# Altium schematic sheet MCU_ESP32S3FH4R2.SchDoc
size A4; SheetNumber: 6; SheetTotal: 7
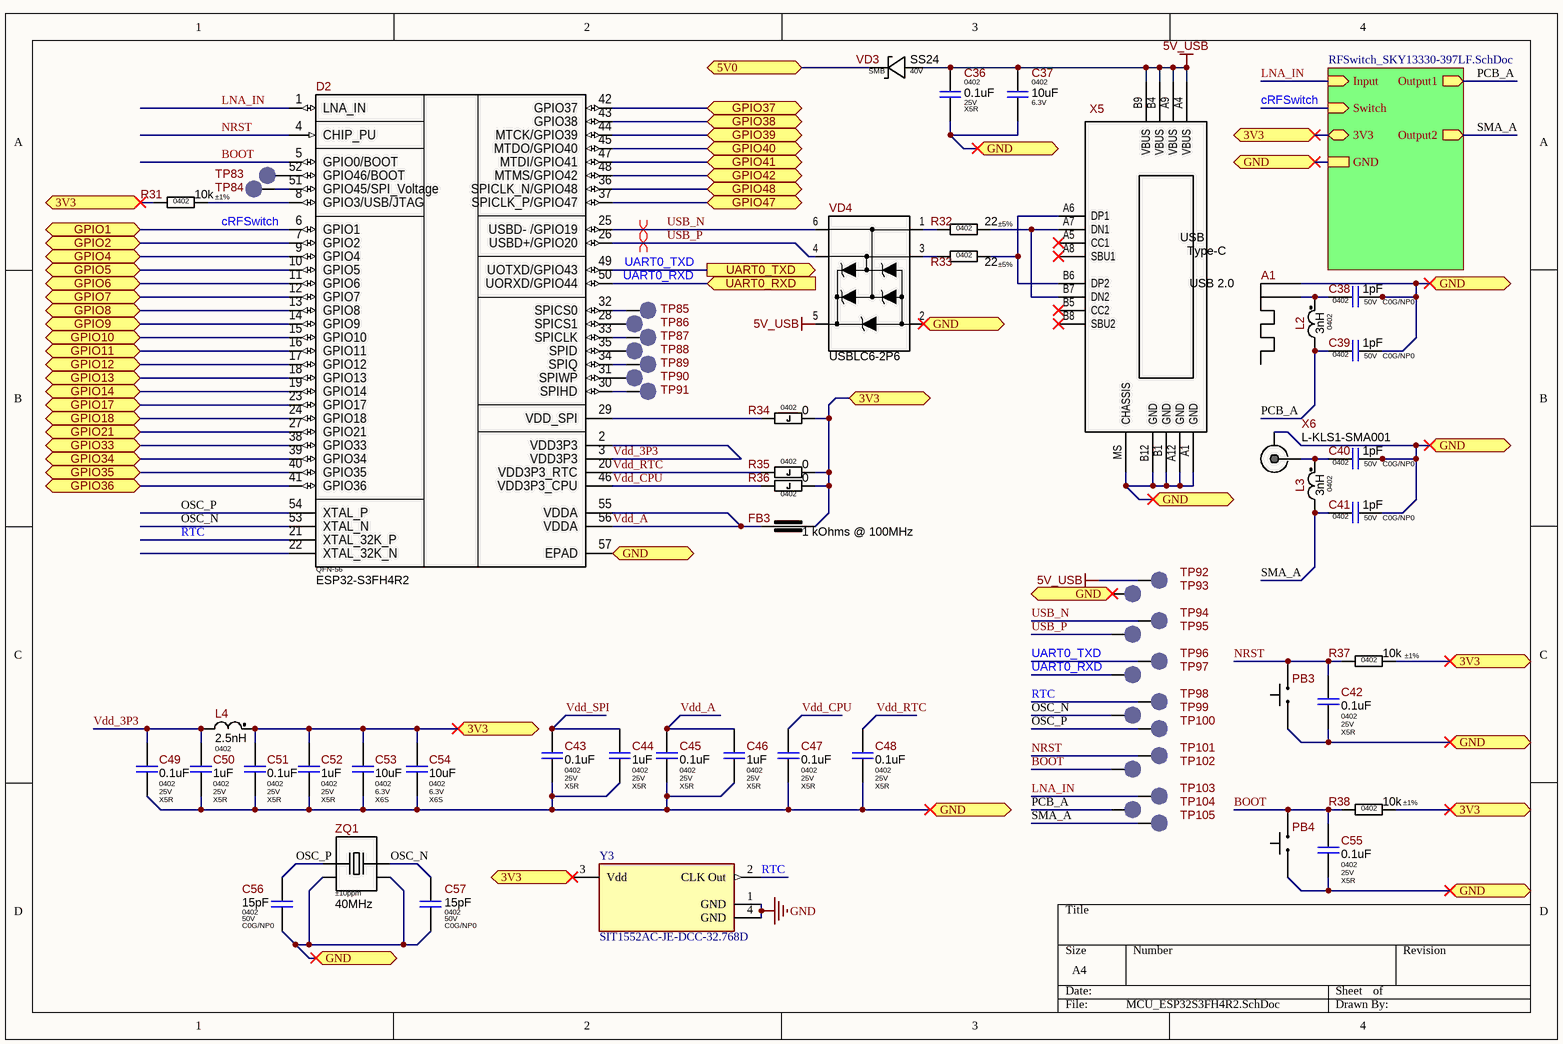
[diagram p0: MCU_ESP32S3FH4R2.SchDoc]

## Parts
A1  PCB Antenna 2.4GHz  [PCB ANTENNA 2.4GHZ]  (value not drawn)  (net tie, no BOM)
C36  Package: 0402  Voltage: 25V  Dielectric Type: X5R  [C_CERAMIC_0402_MED]  (hidden comment: 0.1uF)
C37  Package: 0402  Voltage: 6.3V  [C_CERAMIC_0402_MED]  (hidden comment: 10uF)
C38  value 1pF  Package: 0402  Voltage: 50V  Dielectric Type: C0G/NP0  [C_CERAMIC_0402_MED]  (hidden comment: 1.0pF)
C39  value 1pF  Package: 0402  Voltage: 50V  Dielectric Type: C0G/NP0  [C_CERAMIC_0402_MED]  (hidden comment: 1.0pF)
C40  value 1pF  Package: 0402  Voltage: 50V  Dielectric Type: C0G/NP0  [C_CERAMIC_0402_MED]  (hidden comment: 1.0pF)
C41  value 1pF  Package: 0402  Voltage: 50V  Dielectric Type: C0G/NP0  [C_CERAMIC_0402_MED]  (hidden comment: 1.0pF)
C42  Package: 0402  Voltage: 25V  Dielectric Type: X5R  [C_CERAMIC_0402_HI]  (hidden comment: 0.1uF)
C43  Package: 0402  Voltage: 25V  Dielectric Type: X5R  [C_CERAMIC_0402_MED]  (hidden comment: 0.1uF)
C44  Package: 0402  Voltage: 25V  Dielectric Type: X5R  [C_CERAMIC_0402_MED]  (hidden comment: 1uF)
C45  Package: 0402  Voltage: 25V  Dielectric Type: X5R  [C_CERAMIC_0402_MED]  (hidden comment: 0.1uF)
C46  Package: 0402  Voltage: 25V  Dielectric Type: X5R  [C_CERAMIC_0402_MED]  (hidden comment: 1uF)
C47  Package: 0402  Voltage: 25V  Dielectric Type: X5R  [C_CERAMIC_0402_MED]  (hidden comment: 0.1uF)
C48  Package: 0402  Voltage: 25V  Dielectric Type: X5R  [C_CERAMIC_0402_MED]  (hidden comment: 0.1uF)
C49  Package: 0402  Voltage: 25V  Dielectric Type: X5R  [C_CERAMIC_0402_MED]  (hidden comment: 0.1uF)
C50  Package: 0402  Voltage: 25V  Dielectric Type: X5R  [C_CERAMIC_0402_MED]  (hidden comment: 1uF)
C51  Package: 0402  Voltage: 25V  Dielectric Type: X5R  [C_CERAMIC_0402_MED]  (hidden comment: 0.1uF)
C52  Package: 0402  Voltage: 25V  Dielectric Type: X5R  [C_CERAMIC_0402_MED]  (hidden comment: 1uF)
C53  Package: 0402  Voltage: 6.3V  Dielectric Type: X6S  [C_CERAMIC_0402_MED]  (hidden comment: 10uF)
C54  Package: 0402  Voltage: 6.3V  Dielectric Type: X6S  [C_CERAMIC_0402_MED]  (hidden comment: 10uF)
C55  Package: 0402  Voltage: 25V  Dielectric Type: X5R  [C_CERAMIC_0402_HI]  (hidden comment: 0.1uF)
C56  Package: 0402  Voltage: 50V  Dielectric Type: C0G/NP0  [C_CERAMIC_0402_MED]  (hidden comment: 15pF)
C57  Package: 0402  Voltage: 50V  Dielectric Type: C0G/NP0  [C_CERAMIC_0402_MED]  (hidden comment: 15pF)
D2  Package: QFN-56  [QFN-56_ESP32_7X7_EXP]  (hidden comment: ESP32-S3FH4R2)
FB3  value 1 kOhms @ 100MHz  [BLM15xxxxxSN1x_MED]  (hidden comment: BLM15AX102SN1D)
L2  Package: 0402  [MLG1005S_MED]  (hidden comment: 3nH)
L3  Package: 0402  [MLG1005S_MED]  (hidden comment: 3nH)
L4  Package: 0402  [LQW15ANxxxx00x_REC]  (hidden comment: 2.5nH)
PB3  DS1042-24-2017VBR16005  [DS1042-24-2017VB]  (value not drawn)
PB4  DS1042-24-2017VBR16005  [DS1042-24-2017VB]  (value not drawn)
R31  Tolerance: ±1%  Package: 0402  [R_ANY_CHIP_0402_MED]  (hidden comment: 10k)
R32  Tolerance: ±5%  Package: 0402  [R_ANY_CHIP_0402_MED]  (hidden comment: 22)
R33  Tolerance: ±5%  Package: 0402  [R_ANY_CHIP_0402_MED]  (hidden comment: 22)
R34  Package: 0402  [R_ANY_CHIP_0402_MED]  (hidden comment: 0)
R35  Package: 0402  [R_ANY_CHIP_0402_MED]  (hidden comment: 0)
R36  Package: 0402  [R_ANY_CHIP_0402_MED]  (hidden comment: 0)
R37  Tolerance: ±1%  Package: 0402  [R_ANY_CHIP_0402_MED]  (hidden comment: 10k)
R38  Tolerance: ±1%  Package: 0402  [R_ANY_CHIP_0402_MED]  (hidden comment: 10k)
TP83  LED_LINK  [TP_SMD_2mm]  (value not drawn)  (no BOM)
TP84  LED_LINK  [TP_SMD_2mm]  (value not drawn)  (no BOM)
TP85  LED_LINK  [TP_SMD_2mm]  (value not drawn)  (no BOM)
TP86  LED_LINK  [TP_SMD_2mm]  (value not drawn)  (no BOM)
TP87  LED_LINK  [TP_SMD_2mm]  (value not drawn)  (no BOM)
TP88  LED_LINK  [TP_SMD_2mm]  (value not drawn)  (no BOM)
TP89  LED_LINK  [TP_SMD_2mm]  (value not drawn)  (no BOM)
TP90  LED_LINK  [TP_SMD_2mm]  (value not drawn)  (no BOM)
TP91  LED_LINK  [TP_SMD_2mm]  (value not drawn)  (no BOM)
TP92  LED_LINK  [TP_SMD_2mm]  (value not drawn)  (no BOM)
TP93  LED_LINK  [TP_SMD_2mm]  (value not drawn)  (no BOM)
TP94  LED_LINK  [TP_SMD_2mm]  (value not drawn)  (no BOM)
TP95  LED_LINK  [TP_SMD_2mm]  (value not drawn)  (no BOM)
TP96  LED_LINK  [TP_SMD_2mm]  (value not drawn)  (no BOM)
TP97  LED_LINK  [TP_SMD_2mm]  (value not drawn)  (no BOM)
TP98  LED_LINK  [TP_SMD_2mm]  (value not drawn)  (no BOM)
TP99  LED_LINK  [TP_SMD_2mm]  (value not drawn)  (no BOM)
TP100  LED_LINK  [TP_SMD_2mm]  (value not drawn)  (no BOM)
TP101  LED_LINK  [TP_SMD_2mm]  (value not drawn)  (no BOM)
TP102  LED_LINK  [TP_SMD_2mm]  (value not drawn)  (no BOM)
TP103  LED_LINK  [TP_SMD_2mm]  (value not drawn)  (no BOM)
TP104  LED_LINK  [TP_SMD_2mm]  (value not drawn)  (no BOM)
TP105  LED_LINK  [TP_SMD_2mm]  (value not drawn)  (no BOM)
VD3  Package: SMB  Voltage: 40V  [SMB_MED]  (hidden comment: SS24)
VD4  USBLC6-2P6  [SOT-666]
X5  USB4105-GF-A  [USB4105-GF-A]  (value not drawn)
X6  KLS1-SMA001  [L-KLS1-SMA001]  (value not drawn)
Y3  SIT1552AC-JE-DCC-32.768D  [FP-SiT1552-J-MFG]
ZQ1  Frequency Tolerance: ±10ppm  Frequency: 40MHz  [CXA-221_REC]  (hidden comment: CXA-040000-2F8F31)

## Sub-sheets
LDO_3V3 = RFSwitch_SKY13330-397LF.SchDoc: Input (in), GND, Switch (in), Output1 (out), Output2 (out), 3V3 (bidir)

## Ports
3V3 (bidir, see EL.MBRD.T01[4C], DC-DC_5V0_To_3V3[3B], MCU_STM32L010K4T6[1A], MCU_STM32L010K4T6[1C], MCU_STM32L010K4T6[2C], MCU_STM32L010K4T6[4A], MCU_STM32L010K4T6[4B], RFSwitch_SKY13330-397LF[1B], RS-485_SN65HVD72DRBR[1B]), 5V0 (bidir, see EL.MBRD.T01[5C]), GND (bidir, see EL.MBRD.T01[4C], RFSwitch_SKY13330-397LF[1B], RFSwitch_SKY13330-397LF[1C], RFSwitch_SKY13330-397LF[3C], RFSwitch_SKY13330-397LF[4B], RFSwitch_SKY13330-397LF[4C]), GPIO1 (bidir, see EL.MBRD.T01[4D]), GPIO2 (bidir, see EL.MBRD.T01[4D]), GPIO4 (bidir, see EL.MBRD.T01[4D]), GPIO5 (bidir, see EL.MBRD.T01[4D]), GPIO6 (bidir, see EL.MBRD.T01[4D]), GPIO7 (bidir, see EL.MBRD.T01[4D]), GPIO8 (bidir, see EL.MBRD.T01[4D]), GPIO9 (bidir, see EL.MBRD.T01[4D]), GPIO10 (bidir, see EL.MBRD.T01[4D]), GPIO11 (bidir, see EL.MBRD.T01[4D]), GPIO12 (bidir, see EL.MBRD.T01[4D]), GPIO13 (bidir, see EL.MBRD.T01[4D]), GPIO14 (bidir, see EL.MBRD.T01[4D]), GPIO17 (bidir, see EL.MBRD.T01[4D]), GPIO18 (bidir, see EL.MBRD.T01[5D]), GPIO21 (bidir, see EL.MBRD.T01[5D]), GPIO33 (bidir, see EL.MBRD.T01[5D]), GPIO34 (bidir, see EL.MBRD.T01[5D]), GPIO35 (bidir, see EL.MBRD.T01[5D]), GPIO36 (bidir, see EL.MBRD.T01[5D]), GPIO37 (bidir, see EL.MBRD.T01[5D]), GPIO38 (bidir, see EL.MBRD.T01[5D]), GPIO39 (bidir, see EL.MBRD.T01[5D]), GPIO40 (bidir, see EL.MBRD.T01[5D]), GPIO41 (bidir, see EL.MBRD.T01[5D]), GPIO42 (bidir), GPIO47 (bidir, see EL.MBRD.T01[5D]), GPIO48 (bidir, see EL.MBRD.T01[5D]), UART0_RXD (in), UART0_TXD (out)

## Nets
5V_USB: C36.1 C37.1 TP92.1 VD3.AN VD4.5(VBUS) X5.A4(VBUS) X5.A9(VBUS) X5.B4(VBUS) X5.B9(VBUS)
GND: Y3.1(GND) Y3.4(GND)
3V3: C51.1 C52.1 C53.1 C54.1 FB3.1 L4.1 R31.2 R34.1 R35.1 R36.1 R37.1 R38.1 Y3.3(Vdd) ; port 3V3, sheet LDO_3V3/3V3
5V0: VD3.CA ; port 5V0
BOOT: C55.1 D2.5(GPIO0/BOOT) PB4.2 R38.2 TP102.1
cRFSwitch: D2.6(GPIO1) ; port GPIO1, sheet LDO_3V3/Switch
GND: A1.1(FEED) C36.2 C37.2 C38.2 C39.2 C40.2 C41.2 C42.2 C43.2 C44.1 C45.2 C46.2 C47.2 C48.2 C49.2 C50.2 C51.2 C52.2 C53.2 C54.2 C55.2 C56.2 C57.2 D2.57(EPAD) PB3.1 PB4.1 TP93.1 VD4.2(GND) X5.A1(GND) X5.A12(GND) X5.B1(GND) X5.B12(GND) X5.MS(CHASSIS) X6.2 ZQ1.2(NC1) ZQ1.4(NC2) ; port GND, sheet LDO_3V3/GND  [a separate net that carries the same name]
GPIO2: D2.7(GPIO2) ; port GPIO2
GPIO4: D2.9(GPIO4) ; port GPIO4
GPIO5: D2.10(GPIO5) ; port GPIO5
GPIO6: D2.11(GPIO6) ; port GPIO6
GPIO7: D2.12(GPIO7) ; port GPIO7
GPIO8: D2.13(GPIO8) ; port GPIO8
GPIO9: D2.14(GPIO9) ; port GPIO9
GPIO10: D2.15(GPIO10) ; port GPIO10
GPIO11: D2.16(GPIO11) ; port GPIO11
GPIO12: D2.17(GPIO12) ; port GPIO12
GPIO13: D2.18(GPIO13) ; port GPIO13
GPIO14: D2.19(GPIO14) ; port GPIO14
GPIO17: D2.23(GPIO17) ; port GPIO17
GPIO18: D2.24(GPIO18) ; port GPIO18
GPIO21: D2.27(GPIO21) ; port GPIO21
GPIO33: D2.38(GPIO33) ; port GPIO33
GPIO34: D2.39(GPIO34) ; port GPIO34
GPIO35: D2.40(GPIO35) ; port GPIO35
GPIO36: D2.41(GPIO36) ; port GPIO36
GPIO37: D2.42(GPIO37) ; port GPIO37
GPIO38: D2.43(GPIO38) ; port GPIO38
GPIO39: D2.44(MTCK/GPIO39) ; port GPIO39
GPIO40: D2.45(MTDO/GPIO40) ; port GPIO40
GPIO41: D2.47(MTDI/GPIO41) ; port GPIO41
GPIO42: D2.48(MTMS/GPIO42) ; port GPIO42
GPIO47: D2.37(SPICLK_P/GPIO47) ; port GPIO47
GPIO48: D2.36(SPICLK_N/GPIO48) ; port GPIO48
LNA_IN: D2.1(LNA_IN) TP103.1 ; sheet LDO_3V3/Input
NRST: C42.1 D2.4(CHIP_PU) PB3.2 R37.2 TP101.1
OSC_N: C57.1 D2.53(XTAL_N) TP99.1 ZQ1.1(XTAL1)
OSC_P: C56.1 D2.54(XTAL_P) TP100.1 ZQ1.3(XTAL2)
PCB_A: C39.1 L2.2 TP104.1 ; sheet LDO_3V3/Output1
RTC: D2.21(XTAL_32K_P) TP98.1 Y3.2(CLK_Out)
SMA_A: C41.1 L3.2 TP105.1 ; sheet LDO_3V3/Output2
UART0_RXD: D2.50(UORXD/GPIO44) TP97.1 ; port UART0_RXD
UART0_TXD: D2.49(UOTXD/GPIO43) TP96.1 ; port UART0_TXD
USB_N: D2.25(USBD-_/GPIO19) TP94.1 VD4.6(D+OUT)
USB_P: D2.26(USBD+/GPIO20) TP95.1 VD4.4(D-OUT)
Vdd_3P3: C49.1 C50.1 D2.2(VDD3P3) D2.3(VDD3P3) L4.2
Vdd_A: C45.1 C46.1 D2.55(VDDA) D2.56(VDDA) FB3.2
Vdd_CPU: C47.1 D2.46(VDD3P3_CPU) R36.2
Vdd_RTC: C48.1 D2.20(VDD3P3_RTC) R35.2
Vdd_SPI: C43.1 C44.2
NetA1_2: A1.2(GND) C38.1 L2.1
NetC40_1: C40.1 L3.1 X6.1
NetD2_8: D2.8(GPIO3/USB/JTAG) R31.1
NetD2_28: D2.28(SPICS1) TP86.1
NetD2_29: D2.29(VDD_SPI) R34.2
NetD2_30: D2.30(SPIHD) TP91.1
NetD2_31: D2.31(SPIWP) TP90.1
NetD2_32: D2.32(SPICS0) TP85.1
NetD2_33: D2.33(SPICLK) TP87.1
NetD2_34: D2.34(SPIQ) TP89.1
NetD2_35: D2.35(SPID) TP88.1
NetD2_51: D2.51(GPIO45/SPI_Voltage) TP84.1
NetD2_52: D2.52(GPIO46/BOOT) TP83.1
NetR32_1: R32.1 VD4.1(D+IN)
NetR32_2: R32.2 X5.A7(DN1) X5.B7(DN2)
NetR33_1: R33.1 VD4.3(D-IN)
NetR33_2: R33.2 X5.A6(DP1) X5.B6(DP2)

Not connected (* = marked no-connect by the designer): D2 22(XTAL_32K_N); X5 A5(CC1)* A8(SBU1)* B5(CC2)* B8(SBU2)*

## Layout directives
differential pair: USB_N, USB_P

## Notes on the sheet
- (in symbol USB4105-GF-A) Type-C; USB 2.0

## Library data of the parts
A1 = 2.4GHZ-PCB-ANT: Replacement: NONE; Part Number: 2.4GHZ-PCB-ANT; Component Type: SMD; Temperature Range: NONE; ComponentLink1URL: NONE; Price: NONE; ComponentLink1Description: Datasheet
C36 C43 C45 C47-C49 C51 = Capacitor-NonPolar: 100nF 25V X5R ±10% 0402 Ceramic Capacitor RoHS; Part Number: CL05A104KA5NNNC; Manufacturer: Samsung Electro-Mechanics; Standard Lead Time: 38 Weeks; Replacement: NONE; Component Status: Released; Value: 0.1uF; Part Type: Ceramic / X5R / 0402; Component Type: SMD; Temperature Range: -55°C ~ 85°C; Tolerance: ±10%; ComponentLink1URL: https://eu.mouser.com/datasheet/2/585/MLCC-1837944.pdf; Supplier 1: Mouser; Supplier Part Number 1: 187-CL05A104KA5NNNC; ComponentLink1Description: Datasheet; Price: 0.0013
C37 = Capacitor-NonPolar: 10uF 6.3V X6S ±20% 0402 Ceramic Capacitor RoHS; Part Number: GRM155C80J106ME11D; Manufacturer: Murata Electronics; Standard Lead Time: 15 Weeks; Component Status: Released; Replacement: NONE; Value: 10uF; Part Type: Ceramic / X6S / 0402; Component Type: SMD; Temperature Range: -55°C ~ 105°C; Tolerance: ±20%; Dielectric Type: X6S; ComponentLink1URL: https://search.murata.co.jp/Ceramy/image/img/A01X/G101/ENG/GRM155C80J106ME11-01.pdf; Price: 0,01104; ComponentLink1Description: Datasheet; Supplier 1: Digi-Key; Supplier Part Number 1: 490-13233-1-ND
C38-C41 = Capacitor-NonPolar: 1.0pF 50V NP0 ±0.1pF 0402 Ceramic Capacitor RoHS; Part Number: CL05C010BB5NNNC; Manufacturer: Samsung Electro-Mechanics; Standard Lead Time: 22 Weeks; Replacement: NONE; Component Status: Released; Part Type: Ceramic / C0G(NP0) / 0402; Component Type: SMD; Temperature Range: -55°C ~ 125°C; Tolerance: ±0.1pF; ComponentLink1URL: https://media.digikey.com/pdf/Data%20Sheets/Samsung%20PDFs/CL_Series_MLCC_ds.pdf; Supplier 1: Digi-Key; Supplier Part Number 1: 1276-1237-2-ND; Price: 0,00237556; ComponentLink1Description: Datasheet
C42 C55 = CL05A104KA5NNNC: 100nF 25V X5R ±10% 0402 Ceramic Capacitor RoHS; Manufacturer: Samsung Electro-Mechanics; Standard Lead Time: 38 Weeks; Replacement: NONE; Component Status: Released; Value: 0.1uF; Part Number: CL05A104KA5NNNC; Part Type: Ceramic / X5R / 0402; Component Type: SMD; Temperature Range: -55°C ~ 85°C; Tolerance: ±10%; ComponentLink1URL: https://eu.mouser.com/datasheet/2/585/MLCC-1837944.pdf; Supplier 1: Mouser; Supplier Part Number 1: 187-CL05A104KA5NNNC; ComponentLink1Description: Datasheet; Price: 0.0013
C44 C46 C50 C52 = Capacitor-NonPolar: 1uF 25V Х5R ±10% 0402 Ceramic Capacitor RoHS; Part Number: GRM155R61E105KA12D; Manufacturer: Murata Electronics; Standard Lead Time: 15 Weeks; Component Status: Released; Replacement: NONE; Value: 1uF; Part Type: Ceramic / X5R / 0402; Component Type: SMD; Temperature Range: -55°C ~ 85°C; Tolerance: ±10%; ComponentLink1URL: https://search.murata.co.jp/Ceramy/image/img/A01X/G101/ENG/GRM155R61E105KA12-01.pdf; Supplier 1: Digi-Key; Supplier Part Number 1: 490-10017-1-ND; Price: 0.0033; ComponentLink1Description: Datasheet
C53 C54 = Capacitor-NonPolar: 10uF 6.3V X6S ±20% 0402 Ceramic Capacitor RoHS; Part Number: GRM155C80J106ME11D; Manufacturer: Murata Electronics; Standard Lead Time: 15 Weeks; Replacement: NONE; Component Status: Released; Value: 10uF; Part Type: Ceramic / X6S / 0402; Component Type: SMD; Temperature Range: -55°C ~ 105°C; Tolerance: ±20%; ComponentLink1URL: https://search.murata.co.jp/Ceramy/image/img/A01X/G101/ENG/GRM155C80J106ME11-01.pdf; Supplier 1: Digi-Key; Supplier Part Number 1: 490-13233-1-ND; ComponentLink1Description: Datasheet; Price: 0,01104
C56 C57 = Capacitor-NonPolar: 15pF 50V C0G ±1% 0402 Ceramic Capacitor RoHS; Part Number: GRM1555C1H150FA01D; Manufacturer: Murata Electronics; Standard Lead Time: 15 Weeks; Replacement: NONE; Component Status: Released; Value: 15pF; Part Type: Ceramic / C0G(NP0) / 0402; Component Type: SMD; Temperature Range: -55°C ~ 125°C; Tolerance: ±1%; ComponentLink1URL: https://search.murata.co.jp/Ceramy/image/img/A01X/G101/ENG/GRM1555C1H150FA01-01.pdf; Supplier 1: Digi-Key; Supplier Part Number 1: 490-6200-2-ND; ComponentLink1Description: Datasheet; Price: 0.00485
D2 = ESP32-S3: 2.4GHz WiFi 802.11b/g/n, Bluetooth v5.0 Transceiver Module, 2 MB DRAM, 150 Mb/s max, QFN-56; Manufacturer: Espressif; Standard Lead Time: 11 Weeks; Component Status: Released; Replacement: NONE; Part Number: ESP32-S3FH4R2; Part Type: SoC / Bluetooth, Wi-Fi; Component Type: SMD; Temperature Range: -40°C ~ 105°C; ComponentLink1URL: https://www.espressif.com/sites/default/files/documentation/esp32-s3_datasheet_en.pdf; Supplier 1: Mouser; Supplier Part Number 1: 356-ESP32-S3FH4R2; Price: 2,4; ComponentLink1Description: Datasheet
FB3 = Ferrite-Bead: 1 kOhms @ 100MHz Ferrite Bead 0402, 350mA 490mOhm; Manufacturer: Murata Electronics; Current: 0.35A; Saturation Current: NONE; Tolerance: ±25%; Standard Lead Time: 7 Weeks; Component Status: Released; Package: 0402; Part Number: BLM15AX102SN1D; Part Type: Ferrite Bead; Component Type: SMD; Temperature Range: -55°C ~ 125°C; ComponentLink1URL: https://www.murata.com/en-us/products/productdata/8796740059166/ENFA0018.pdf; Supplier 1: Digi-Key; Supplier Part Number 1: 490-5442-2-ND; Replacement: NONE; Price: 0.00265; ComponentLink1Description: Datasheet
L2 L3 = Inductor-Multilayer-Fixed-RF: 3nH Unshielded Multilayer Inductor 800mA 200mOhm Max, 0402; Part Number: MLG1005S3N0ST000; Manufacturer: TDK; Current: 0.8A; Saturation Current: NONE; Tolerance: ±0.3nH; Standard Lead Time: 12 Weeks; Component Status: Released; Value: 3nH; Part Type: RF / Multilayer; Component Type: SMD; Temperature Range: -55°C ~ 125°C; ComponentLink1URL: https://product.tdk.com/info/en/catalog/datasheets/inductor_commercial_high-frequency_mlg1005s_en.pdf; Supplier 1: Digi-Key; Supplier Part Number 1: 445-3046-2-ND; Replacement: NONE; Price: 0,01134067; ComponentLink1Description: Datasheet
L4 = Inductor-Air-Fixed-RF: 2.5nH Unshielded Wirewound RF Inductor 2.1A 30mOhm Max, 0402; Part Number: LQW15AN2N5C80D; Manufacturer: Murata Electronics; Saturation Current: NONE; Tolerance: ±0.2nH; Standard Lead Time: 6 Weeks; Component Status: Released; Value: 2.5nH; Part Type: RF / Wirewound; Current: 2.1A; Component Type: SMD; Temperature Range: -55°C ~ 125°C; ComponentLink1URL: https://eu.mouser.com/datasheet/2/281/1/JELF243A_0100-1380931.pdf; Supplier 1: Mouser; Supplier Part Number 1: 81-LQW15AN2N5C80D; Replacement: NONE; Price: 0,1318; ComponentLink1Description: Datasheet
PB3 PB4 = DS1042-24-2017VBR16005: Tactile Switch 2.5x3mm, SMD, 160gf, Height 1.7mm, 50mA 12VDC; Manufacturer: Connfly; Replacement: NONE; Part Number: DS1042-24-2017VBR16005; Part Type: Switch / Tactile; Component Type: SMD; Temperature Range: -20°C ~ 70°C
R31 R37 R38 = RC0402FR-0710KL: 10 kOhms ±1% 1/16W 0402 Thick Film Resistor; Manufacturer: Yageo; Power Rating: 0.062W; Voltage: 50V; Temperature Stability: ±100ppm/°C; Replacement: NONE; Component Status: Released; Value: 10k; Part Number: RC0402FR-0710KL; Component Type: SMD; Temperature Range: -55°C ~ 155°C; ComponentLink1URL: https://eu.mouser.com/datasheet/2/447/PYu_RC_Group_51_RoHS_L_10-1664068.pdf; Supplier 1: Digi-Key; Supplier Part Number 1: 311-10.0KLRTR-ND; ComponentLink1Description: Datasheet; Part Type: Thick Film; Price: 0,00065
R32 R33 = Resistor: 22 Ohms ±5% 1/16W 0402 Thick Film Resistor; Part Number: RC0402JR-0722RL; Manufacturer: Yageo; Power Rating: 0.062W; Voltage: 50V; Temperature Stability: ±100ppm/°C; Replacement: NONE; Component Status: Released; Value: 22; Component Type: SMD; Temperature Range: -55°C ~ 155°C; ComponentLink1URL: https://eu.mouser.com/datasheet/2/447/PYu_RC_Group_51_RoHS_L_10-1664068.pdf; ComponentLink1Description: Datasheet; Price: 0,00045; Part Type: Thick Film
R34-R36 = RC0402JR-070RL: 0 Ohms Jumper ±5% 1/16W 0402 Thick Film Resistor; Manufacturer: Yageo; Power Rating: 0.062W; Voltage: 50V; Component Status: Released; Temperature Stability: NONE; Tolerance: ±5%; Value: 0; Part Number: RC0402JR-070RL; Component Type: SMD; Part Type: Thick Film; Temperature Range: -55°C ~ 155°C; ComponentLink1URL: https://eu.mouser.com/datasheet/2/447/PYu_RC_Group_51_RoHS_L_10-1664068.pdf; Supplier 1: Digi-Key; Supplier Part Number 1: 311-0.0JRTR-ND; Replacement: NONE; Price: 0.00045; ComponentLink1Description: Datasheet
TP83-TP105 = TP-PAD-SMD: Test Point SMD Pad 1.0mm/1.5mm/2mm; Part Number: TP-PAD-SMD; Part Type: Test Point; Component Type: SMD
VD3 = Diode-Schottky: Diode Schottky 40V 2A, SMB; Manufacturer: Vishay Semiconductor; Component Status: Released; Standard Lead Time: 11 Weeks; Vf: 500mV @ 2A; Replacement: NONE; Part Number: SS24; Part Type: Schottky; Component Type: SMD; Marking: SS24; Current: 2A; Temperature Range: -65°C ~ 125°C; ComponentLink1URL: https://www.vishay.com/docs/88748/ss22.pdf; Supplier 1: Digi-Key; Supplier Part Number 1: SS24-E3/52TGITR-ND; Price: 0.03; ComponentLink1Description: Datasheet
VD4 = USBLC6-2: TVS Diode 17V @ 5A (8/20us) Clamping, Very Low Capacitance 3.5pF max, Low Leakage, Rail-to-Rail ESD Protection Diode Array, SOT-666; Manufacturer: STMicroelectronics; Marking: F; Standard Lead Time: 29 Weeks; Voltage: 6V; Replacement: NONE; Component Status: Released; Part Number: USBLC6-2P6; Part Type: TVS / ESD Protection; Component Type: SMD; Package: SOT-666; Temperature Range: -40°C ~ 125°C; ComponentLink1URL: https://www.st.com/content/ccc/resource/technical/document/datasheet/06/1d/48/9c/6c/20/4a/b2/CD00050750.pdf/files/CD00050750.pdf/jcr:content/translations/en.CD00050750.pdf; Supplier 1: Digi-Key; Supplier Part Number 1: 497-5026-2-ND; ComponentLink1Description: Datasheet; Current: 5A; Price: 0,0908
X5 = USB4105-GF-A: USB Type-C Connector, USB2.0, 16 Contacts, Right Angle; Manufacturer: GCT; Replacement: NONE; Component Status: Released; Part Number: USB4105-GF-A; Part Type: USB; Component Type: SMD; Temperature Range: -40°C ~ 85°C; ComponentLink1URL: https://eu.mouser.com/datasheet/2/837/USB4105-2888174.pdf; Supplier 1: Digi-Key; Supplier Part Number 1: 2073-USB4105-GF-ATR-ND; Price: 0,507; ComponentLink1Description: Datasheet
X6 = L-KLS1-SMA001: 50Ohm SMA Connector, Vertical, Female, 5.08mm; Manufacturer: KLS Electronic; Component Status: Released; Replacement: NONE; Part Type: RF Connector; Component Type: PTH; Temperature Range: -55°C ~ 155°C; Price: 0.4767569; Part Number: L-KLS1-SMA001
Y3 = CMP-25159-260295-1: MEMS OSC TCXO 32.7680KHZ LVCMOS; Frequency Stability: 5ppm; Frequency: 32.768kHz; Min Operating Temperature: 0°C; Length: 0.061inch; Mount: Surface Mount; Max Operating Temperature: 70°C; Width: 0.033inch; RoHS Compliant: Yes; Series: SiT1552; Packaging: Cut Tape; Height: 0.024inch; ComponentLink1Description: Datasheet; ComponentLink1URL: https://eu.mouser.com/datasheet/2/371/SiT1552_datasheet-1511133.pdf; Part Number: SIT1552AC-JE-DCC-32.768D; Supplier 1: Mouser; Supplier Part Number 1: 788-1552ACJEDCC32.7D
ZQ1 = Crystal-Quartz-4-Pin-01: 40MHz 10pF ±10ppm, 60Ohm ESR, 100uW DL Crystal Quartz; Manufacturer: Aker; Standard Lead Time: NONE; Component Status: Released; Part Number: CXA-040000-2F8F31; Part Type: Crystal; Component Type: SMD; Load Capacitance: 10pF; Frequency Stability: ±10ppm; Temperature Range: -20°C ~ 75 °C; ComponentLink1URL: \\altiumdb.ajax.local\files\Datasheet\Oscillators\CXA-040000-2F8F31-1.pdf; Replacement: NONE; ComponentLink1Description: Datasheet; Price: 0,17